# EasyEDA Pro project CyberryPotter-6050-v4.0.eprj, schematic IR
Create Date: 2024-08-04; Page Name: P1; Project Name: CyberryPotter-6050-v3.7; Schematic Name: IR; Update Date: 2024-08-13; Company: 嘉立创EDA; Page Size: A4; Version: V1.0
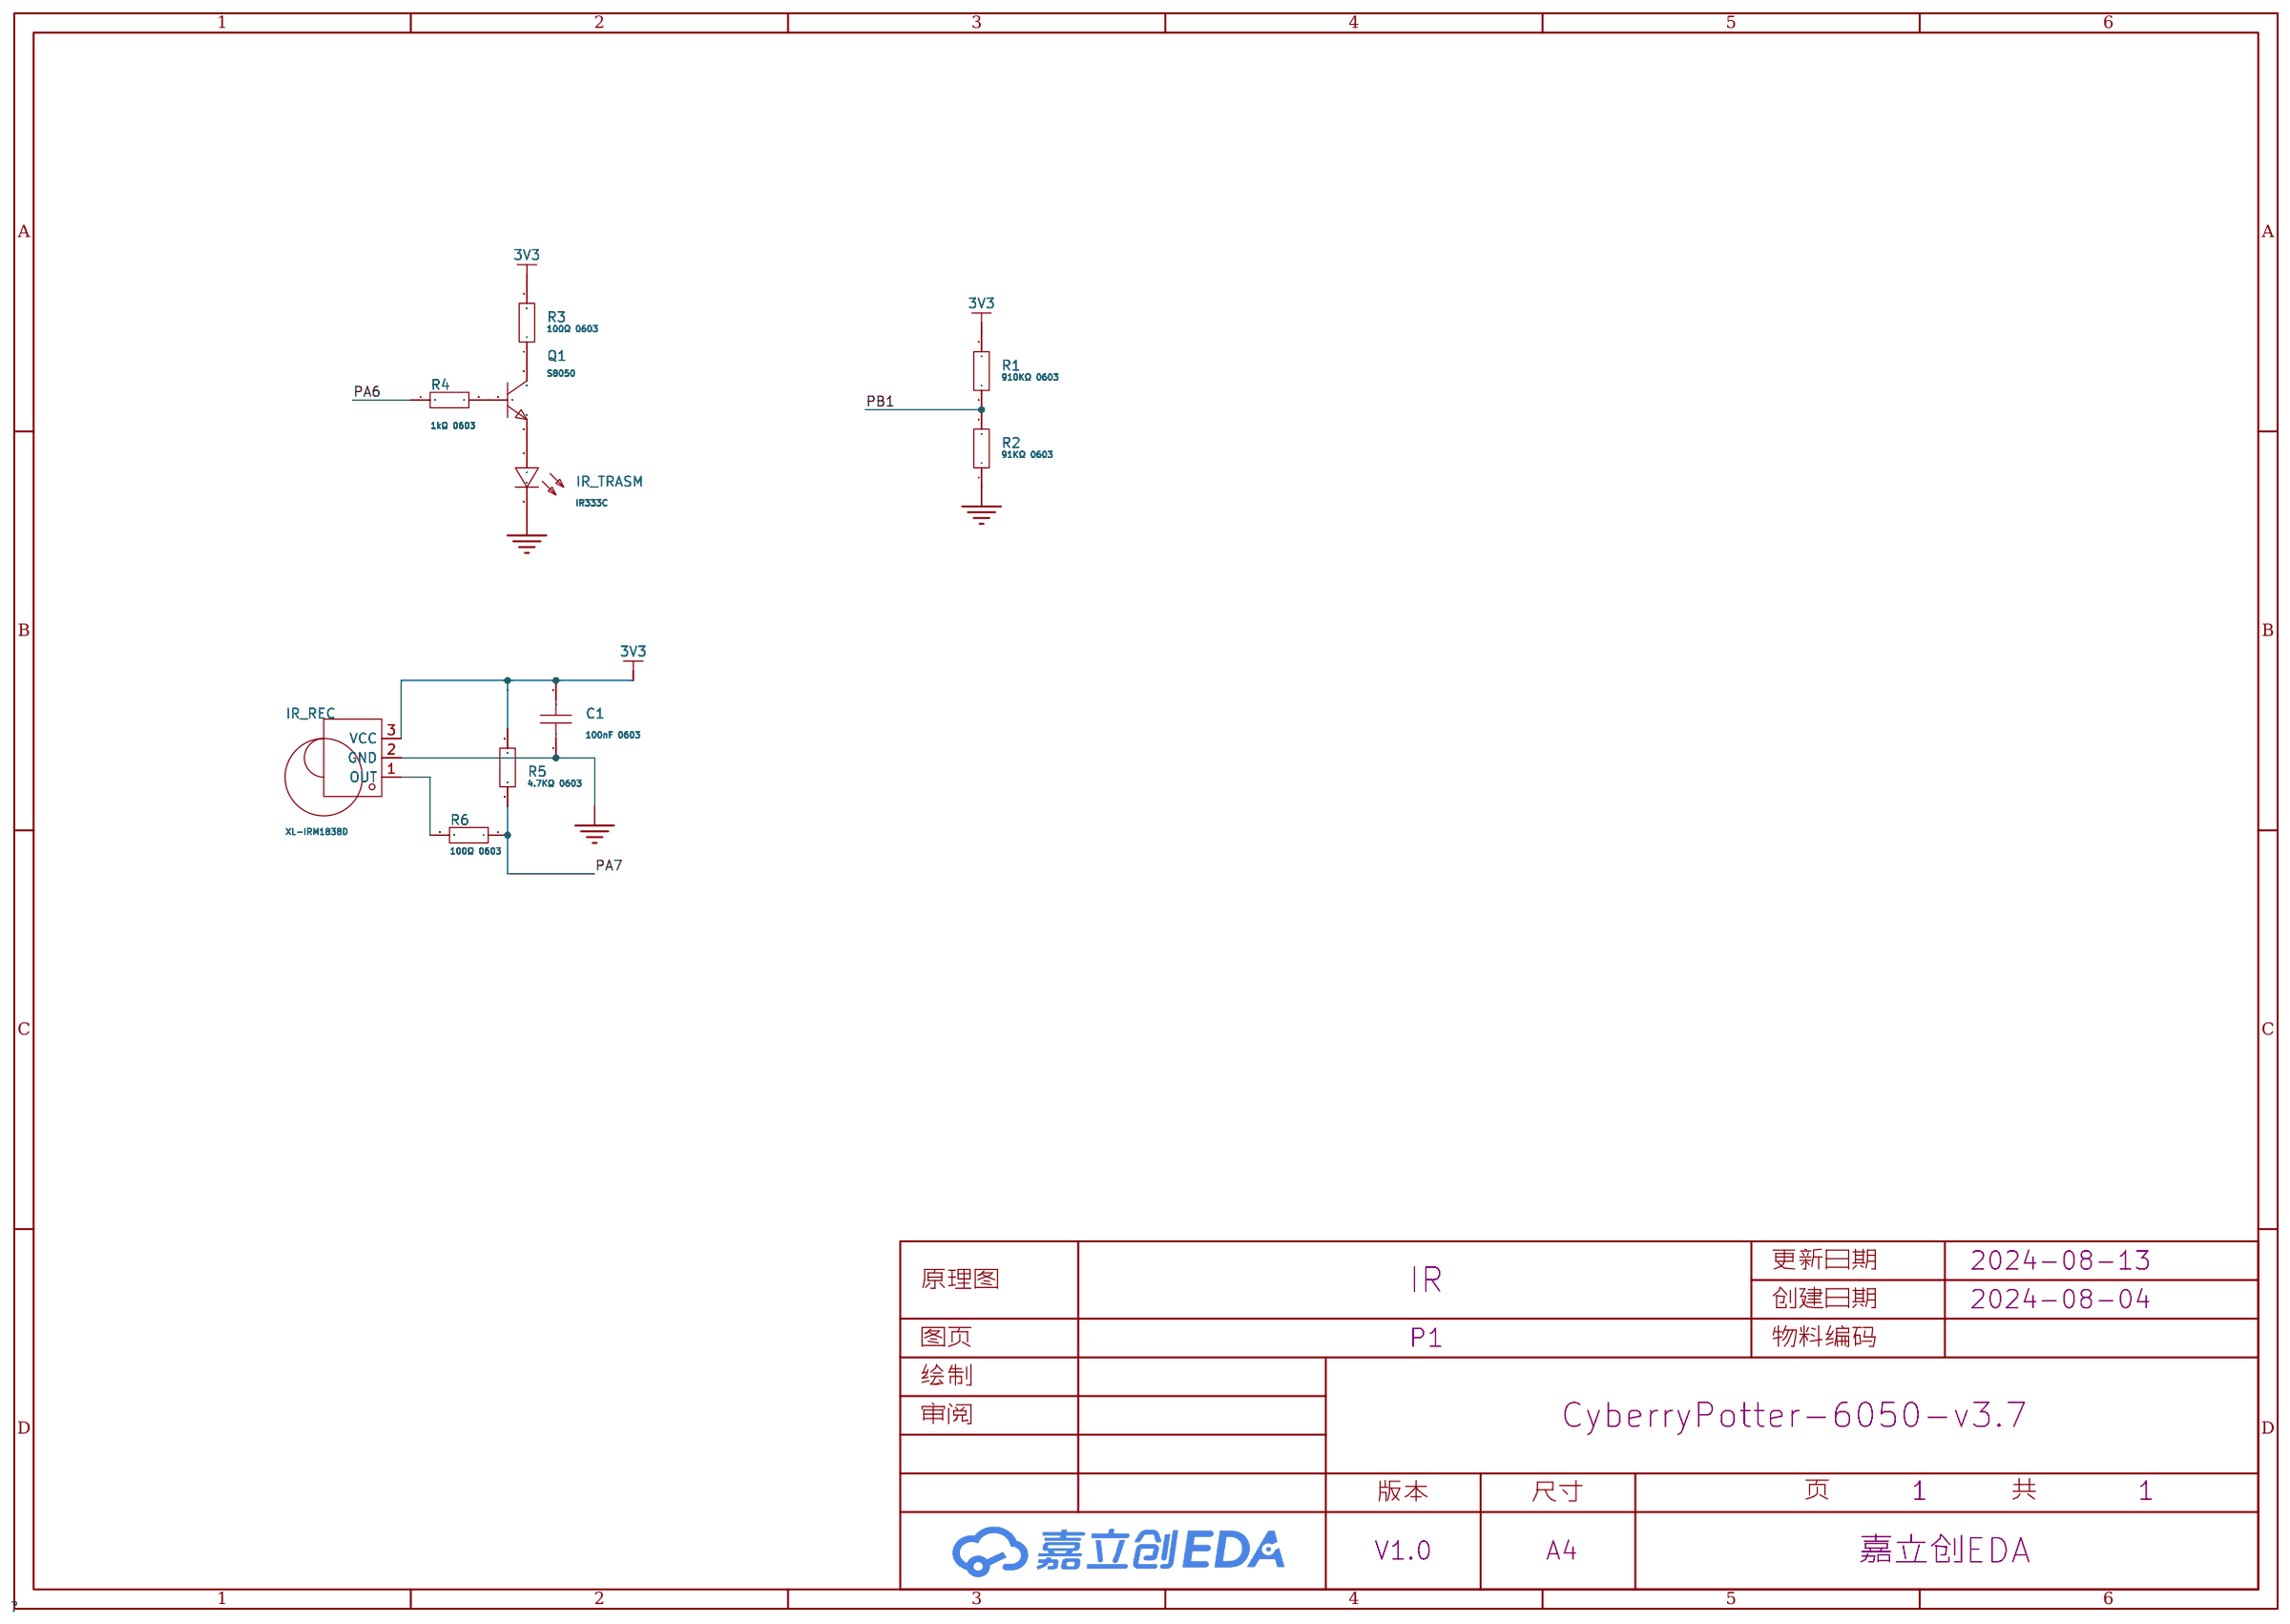
[diagram p0: schematic sheet]

## Parts
C1  100nF 0603  [C0603]
IR_REC  XL-IRM1838D  [OPTO-TH_3P-L7.0-W5.6-P2.54-L]
IR_TRASM  IR333C  [LED-TH_BD5.0-P2.54-FD]
Q1  S8050  [SOT-23-3_L2.9-W1.6-P1.90-LS2.8-BR]
R1  910KΩ 0603  [R0603]
R2  91KΩ 0603  [R0603]
R3  100Ω 0603  [R0603]
R4  1kΩ 0603  [R0603]
R5  4.7KΩ 0603  [R0603]
R6  100Ω 0603  [R0603]

## Library data of the parts
C1 = CC0603KRX7R9BB104: 容值:100nF;精度:±10%;额定电压:50V;材质(温度系数):X7R;; LCSC Part Name: 100nF ±10% 50V; Supplier Part: C14663; Manufacturer: YAGEO(国巨); Supplier Footprint: 0603; JLCPCB Part Class: 基础库; Datasheet: https://atta.szlcsc.com/upload/public/pdf/source/20180910/C282072_33301C7F631E79921B82A8DAC6BCC5B3.pdf; Supplier: LCSC; Tolerance: ±10%; Voltage Rated: 50V; Temperature Coefficient: X7R
IR_REC = XL-IRM1838D: D=7MM;载波频率：37.9KHZ;VDD=2.7-5.5V/插件式红外接收头;低功耗；宽角度及长距离接收/能抵挡环境干扰; Supplier Part: C19725374; Manufacturer: XINGLIGHT(成兴光); Supplier Footprint: SIP-3; JLCPCB Part Class: 扩展库; Datasheet: https://atta.szlcsc.com/upload/public/pdf/source/20240218/FB82743A9784255017BE11F358F9C065.pdf; Supplier: LCSC
IR_TRASM = IR333C: 正向电压:1.2V;波长:940nm;辐射强度:7.8mW/sr@20mA;视角:20°;; LCSC Part Name: 5mm红外LED; Supplier Part: C5200795; Manufacturer: EVERLIGHT(亿光); Supplier Footprint: 插件; JLCPCB Part Class: 扩展库; Datasheet: https://atta.szlcsc.com/upload/public/pdf/source/20221214/25ED07650BA98783E37095EC49136A18.pdf; Supplier: LCSC; Vf - Forward Voltage: 1.2V; Wavelength: 940nm; Radiant Intensity: 7.8mW/sr@20mA; View Angle: 20°; Operating Temperature: -40℃~+85℃
Q1 = S8050_C181158: 晶体管类型:NPN;集电极电流(Ic):500mA;集射极击穿电压(Vceo):25V;功率(Pd):300mW;; LCSC Part Name: NPN 电流:500mA 耐压:25V; Supplier Part: C181158; Manufacturer: Hottech(合科泰); Supplier Footprint: SOT-23; JLCPCB Part Class: 扩展库; Datasheet: https://atta.szlcsc.com/upload/public/pdf/source/20220506/D987F39D56F2975D34EC7947E75C4ABC.pdf; Supplier: LCSC; Transistor Type: NPN; Collector Current (Ic): 500mA; Collector-Emitter Breakdown Voltage (Vceo): 25V; Power Dissipation (Pd): 300mW; Transition Frequency (fT): 150MHz; Collector Cut-Off Current (Icbo): 100nA; Collector-Emitter Saturation Voltage (VCE(sat)@Ic,Ib): 600mV@500mA,50mA
R1-R6 = 0603WAF1002T5E: 电阻类型:厚膜电阻;阻值:10kΩ;精度:±1%;功率:100mW;最大工作电压:75V;温度系数:±100ppm/℃;; LCSC Part Name: 厚膜电阻 10kΩ ±1% 100mW; Supplier Part: C25804; Manufacturer: UNI-ROYAL(厚声); Supplier Footprint: 0603; JLCPCB Part Class: 基础库; Datasheet: https://atta.szlcsc.com/upload/public/pdf/source/20200306/C422600_1E6D84923E4A46A82E41ADD87F860B5C.pdf; Supplier: LCSC; Type: 厚膜电阻; Tolerance: ±1%; Power(Watts): 100mW; Overload Voltage (Max): 75V; Temperature Coefficient: ±100ppm/℃; Operating Temperature Range: -55℃~+155℃

## Nets
3V3: C1.2 IR_REC.3(VCC) R1.2 R3.2 R5.1
GND: C1.1 IR_REC.2(GND) IR_TRASM.2(C) R2.1
PA6: R4.1
PA7: R5.2 R6.1
PB1: R1.1 R2.2
$1N195: IR_TRASM.1(A) Q1.2
$1N793: Q1.1 R4.2
$1N835: Q1.3 R3.1
$1N1035: IR_REC.1(OUT) R6.2
